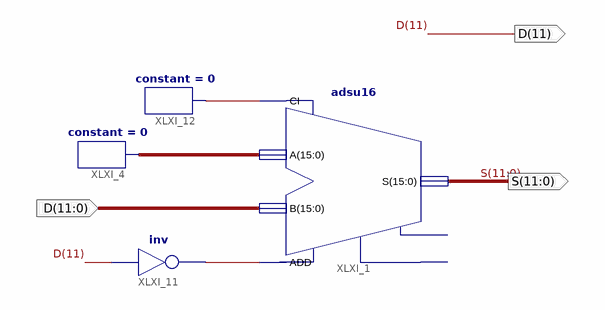
[diagram p0: schematic sheet 1]
// Xilinx ISE schematic circuit.sch (spartan3e) as structural Verilog: 4 symbols, 3 ports
module circuit (
  inout  [11:0] D,
  output [11:0] S
);

  wire XLXN_12;
  wire [15:0] XLXN_16;

  constant #(.CValue("0")) XLXI_4 (.O(XLXN_16));
  adsu16 XLXI_1 (.A(XLXN_16), .ADD(XLXN_12), .B(D), .CI(D[11]), .S(S));  // open: CO, OFL
  not XLXI_11 (XLXN_12, D[11]);
  constant #(.CValue("0")) XLXI_12 (.O(D[11]));
endmodule
